# Altium schematic sheet K7410tFFG900HP.SchDoc
size A3
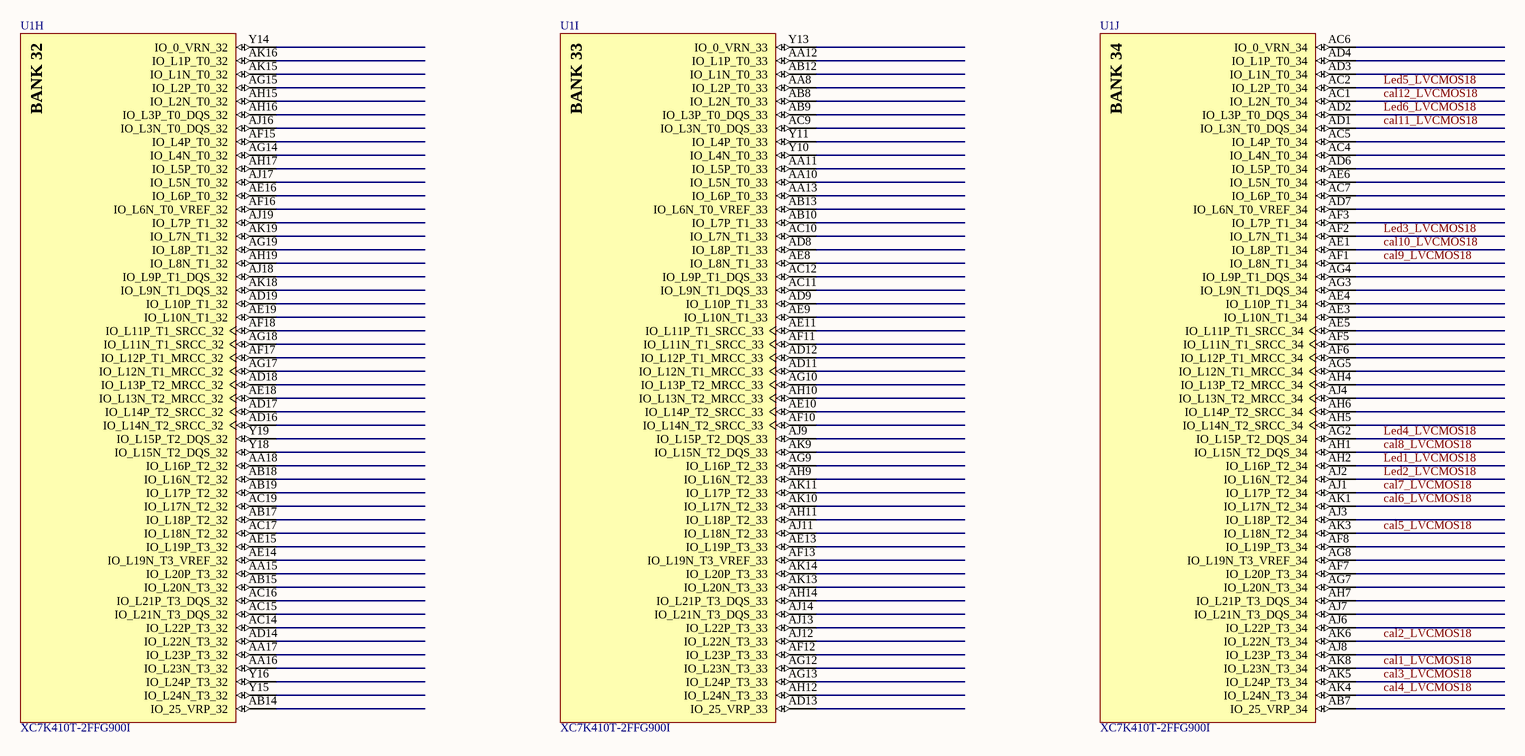
[diagram p0: K7410tFFG900HP.SchDoc]

## Parts
U1  XC7K410T-2FFG900I  [FFG900]  (parts H,I,J of 16)

## Nets
cal1_LVCMOS18: U1.AK8(IO_L23N_T3_34)
cal2_LVCMOS18: U1.AK6(IO_L22N_T3_34)
cal3_LVCMOS18: U1.AK5(IO_L24P_T3_34)
cal4_LVCMOS18: U1.AK4(IO_L24N_T3_34)
cal5_LVCMOS18: U1.AK3(IO_L18N_T2_34)
cal6_LVCMOS18: U1.AK1(IO_L17N_T2_34)
cal7_LVCMOS18: U1.AJ1(IO_L17P_T2_34)
cal8_LVCMOS18: U1.AH1(IO_L15N_T2_DQS_34)
cal9_LVCMOS18: U1.AF1(IO_L8N_T1_34)
cal10_LVCMOS18: U1.AE1(IO_L8P_T1_34)
cal11_LVCMOS18: U1.AD1(IO_L3N_T0_DQS_34)
cal12_LVCMOS18: U1.AC1(IO_L2N_T0_34)
Led1_LVCMOS18: U1.AH2(IO_L16P_T2_34)
Led2_LVCMOS18: U1.AJ2(IO_L16N_T2_34)
Led3_LVCMOS18: U1.AF2(IO_L7N_T1_34)
Led4_LVCMOS18: U1.AG2(IO_L15P_T2_DQS_34)
Led5_LVCMOS18: U1.AC2(IO_L2P_T0_34)
Led6_LVCMOS18: U1.AD2(IO_L3P_T0_DQS_34)

Not connected (* = marked no-connect by the designer): U1 AA8(IO_L2P_T0_33) AA10(IO_L5N_T0_33) AA11(IO_L5P_T0_33) AA12(IO_L1P_T0_33) AA13(IO_L6P_T0_33) AA15(IO_L20P_T3_32) AA16(IO_L23N_T3_32) AA17(IO_L23P_T3_32) AA18(IO_L16P_T2_32) AB7(IO_25_VRP_34) AB8(IO_L2N_T0_33) AB9(IO_L3P_T0_DQS_33) AB10(IO_L7P_T1_33) AB12(IO_L1N_T0_33) AB13(IO_L6N_T0_VREF_33) AB14(IO_25_VRP_32) AB15(IO_L20N_T3_32) AB17(IO_L18P_T2_32) AB18(IO_L16N_T2_32) AB19(IO_L17P_T2_32) AC4(IO_L4N_T0_34) AC5(IO_L4P_T0_34) AC6(IO_0_VRN_34) AC7(IO_L6P_T0_34) AC9(IO_L3N_T0_DQS_33) AC10(IO_L7N_T1_33) AC11(IO_L9N_T1_DQS_33) AC12(IO_L9P_T1_DQS_33) AC14(IO_L22P_T3_32) AC15(IO_L21N_T3_DQS_32) AC16(IO_L21P_T3_DQS_32) AC17(IO_L18N_T2_32) AC19(IO_L17N_T2_32) AD3(IO_L1N_T0_34) AD4(IO_L1P_T0_34) AD6(IO_L5P_T0_34) AD7(IO_L6N_T0_VREF_34) AD8(IO_L8P_T1_33) AD9(IO_L10P_T1_33) AD11(IO_L12N_T1_MRCC_33) AD12(IO_L12P_T1_MRCC_33) AD13(IO_25_VRP_33) AD14(IO_L22N_T3_32) AD16(IO_L14N_T2_SRCC_32) AD17(IO_L14P_T2_SRCC_32) AD18(IO_L13P_T2_MRCC_32) AD19(IO_L10P_T1_32) AE3(IO_L10N_T1_34) AE4(IO_L10P_T1_34) AE5(IO_L11P_T1_SRCC_34) AE6(IO_L5N_T0_34) AE8(IO_L8N_T1_33) AE9(IO_L10N_T1_33) AE10(IO_L14P_T2_SRCC_33) AE11(IO_L11P_T1_SRCC_33) AE13(IO_L19P_T3_33) AE14(IO_L19N_T3_VREF_32) AE15(IO_L19P_T3_32) AE16(IO_L6P_T0_32) AE18(IO_L13N_T2_MRCC_32) AE19(IO_L10N_T1_32) AF3(IO_L7P_T1_34) AF5(IO_L11N_T1_SRCC_34) AF6(IO_L12P_T1_MRCC_34) AF7(IO_L20P_T3_34) AF8(IO_L19P_T3_34) AF10(IO_L14N_T2_SRCC_33) AF11(IO_L11N_T1_SRCC_33) AF12(IO_L23P_T3_33) AF13(IO_L19N_T3_VREF_33) AF15(IO_L4P_T0_32) AF16(IO_L6N_T0_VREF_32) AF17(IO_L12P_T1_MRCC_32) AF18(IO_L11P_T1_SRCC_32) AG3(IO_L9N_T1_DQS_34) AG4(IO_L9P_T1_DQS_34) AG5(IO_L12N_T1_MRCC_34) AG7(IO_L20N_T3_34) AG8(IO_L19N_T3_VREF_34) AG9(IO_L16P_T2_33) AG10(IO_L13P_T2_MRCC_33) AG12(IO_L23N_T3_33) AG13(IO_L24P_T3_33) AG14(IO_L4N_T0_32) AG15(IO_L2P_T0_32) AG17(IO_L12N_T1_MRCC_32) AG18(IO_L11N_T1_SRCC_32) AG19(IO_L8P_T1_32) AH4(IO_L13P_T2_MRCC_34) AH5(IO_L14N_T2_SRCC_34) AH6(IO_L14P_T2_SRCC_34) AH7(IO_L21P_T3_DQS_34) AH9(IO_L16N_T2_33) AH10(IO_L13N_T2_MRCC_33) AH11(IO_L18P_T2_33) AH12(IO_L24N_T3_33) AH14(IO_L21P_T3_DQS_33) AH15(IO_L2N_T0_32) AH16(IO_L3P_T0_DQS_32) AH17(IO_L5P_T0_32) AH19(IO_L8N_T1_32) AJ3(IO_L18P_T2_34) AJ4(IO_L13N_T2_MRCC_34) AJ6(IO_L22P_T3_34) AJ7(IO_L21N_T3_DQS_34) AJ8(IO_L23P_T3_34) AJ9(IO_L15P_T2_DQS_33) AJ11(IO_L18N_T2_33) AJ12(IO_L22N_T3_33) AJ13(IO_L22P_T3_33) AJ14(IO_L21N_T3_DQS_33) AJ16(IO_L3N_T0_DQS_32) AJ17(IO_L5N_T0_32) AJ18(IO_L9P_T1_DQS_32) AJ19(IO_L7P_T1_32) AK9(IO_L15N_T2_DQS_33) AK10(IO_L17N_T2_33) AK11(IO_L17P_T2_33) AK13(IO_L20N_T3_33) AK14(IO_L20P_T3_33) AK15(IO_L1N_T0_32) AK16(IO_L1P_T0_32) AK18(IO_L9N_T1_DQS_32) AK19(IO_L7N_T1_32) Y10(IO_L4N_T0_33) Y11(IO_L4P_T0_33) Y13(IO_0_VRN_33) Y14(IO_0_VRN_32) Y15(IO_L24N_T3_32) Y16(IO_L24P_T3_32) Y18(IO_L15N_T2_DQS_32) Y19(IO_L15P_T2_DQS_32)

## Notes on the sheet
- (in symbol XC7K410T-2FFG900I, part H) BANK 32
- (in symbol XC7K410T-2FFG900I, part I) BANK 33
- (in symbol XC7K410T-2FFG900I, part J) BANK 34

## Library data of the parts
U1 = XC7K410T-2FFG900I: Kintex-7 FPGA, 500 User I/Os, 16 GTX, 900-Ball BGA, Speed Grade 2, Industrial Grade, Pb-Free; Manufacturer: Xilinx; GTX: 16; SelectIO HP: 150; SelectIO HR: 350; Speed Grade: -2; DatasheetVersion: v1.12; PackageVersion: Rev 1.1; PackageReference: FFG900; PackageDescription: Flip-Chip BGA, Body 31 x 31 mm, 1.0 mm Pitch; Generic Part Number: XC7K410T; RoHS: Pb-Free; Mounting Technology: Surface Mount; Code_JEDEC: MS-034-AAN-1; PartNumber: XC7K410T-2FFG900I; ComponentLink1Description: Datasheet; ComponentLink1URL: http://www.xilinx.com/support/documentation/data_sheets/ds180_7Series_Overview.pdf; ComponentLink2Description: Package Specification; ComponentLink2URL: http://www.xilinx.com/support/documentation/user_guides/ug865-Zynq-7000-Pkg-Pinout.pdf